# EAGLE design Retrolite_CM4_-_Right_PCB (EAGLE 9.6.2)
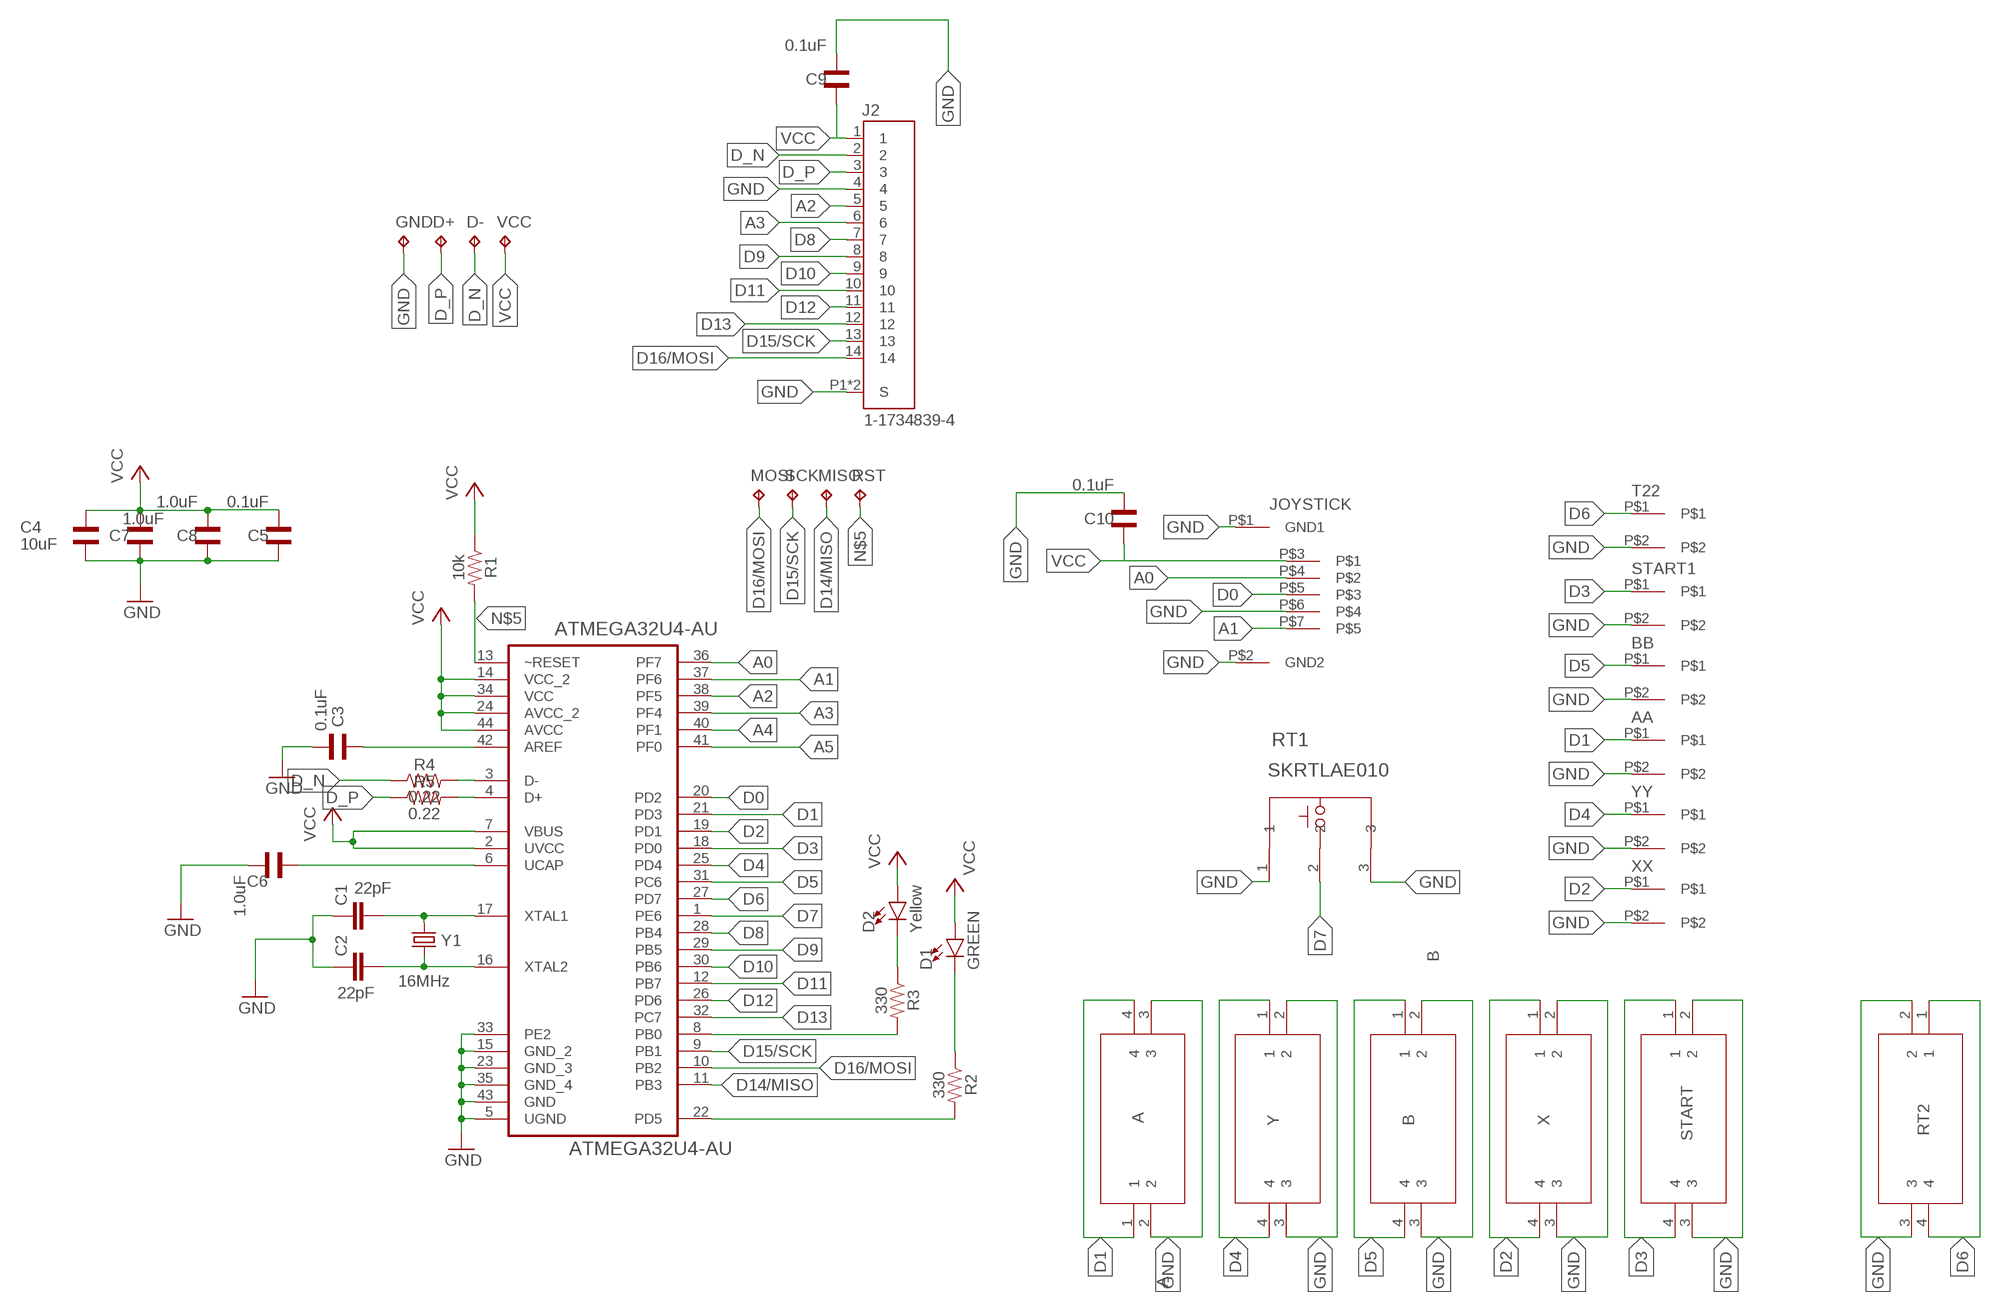
[diagram p0: schematic, sheet 1]

## Parts
A  A  EVQ-Q2B03W  [EVQQ2_3]
AA  MEMBRANEBUTTON  [MEMBRANEBUTTON]
ATMEGA32U4-AU  ATMEGA32U4-AU  [QFP80P1200X1200X120-44N]
B  B  EVQ-Q2B03W  [EVQQ2_3]
BB  MEMBRANEBUTTON  [MEMBRANEBUTTON]
C1  22pF  22PF-0603-50V-5%  [0603]
C2  22pF  22PF-0603-50V-5%  [0603]
C3  0.1uF  WCAP-CSGP_0805_885012006018_WAVE  [WCAP-CSGP_0805_WAVE]
C4  10uF  WCAP-CSGP_0805_885012006018_WAVE  [WCAP-CSGP_0805_WAVE]
C5  0.1uF  WCAP-CSGP_0805_885012006018_WAVE  [WCAP-CSGP_0805_WAVE]
C6  1.0uF  WCAP-CSGP_0805_885012006018_WAVE  [WCAP-CSGP_0805_WAVE]
C7  1.0uF  WCAP-CSGP_0805_885012006018_WAVE  [WCAP-CSGP_0805_WAVE]
C8  1.0uF  WCAP-CSGP_0805_885012006018_WAVE  [WCAP-CSGP_0805_WAVE]
C9  0.1uF  WCAP-CSGP_0805_885012006018_WAVE  [WCAP-CSGP_0805_WAVE]
C10  0.1uF  WCAP-CSGP_0805_885012006018_WAVE  [WCAP-CSGP_0805_WAVE]
D1  GREEN  LED-GREEN0603  [LED-0603]
D2  Yellow  LED-YELLOW0603  [LED-0603]
D+  TPB1,27  [B1,27]
D-  TPB1,27  [B1,27]
GND  TPB1,27  [B1,27]
J2  1-1734839-4  [TE_1-1734839-4]
JOYSTICK  0545500571  [0545500571]
MISO  TPB1,27  [B1,27]
MOSI  TPB1,27  [B1,27]
R1  10k  10KOHM-0603-1/10W-1%  [0603]
R2  330  1.6KOHM-0603-1/10W-1%  [0603]
R3  330  1.6KOHM-0603-1/10W-1%  [0603]
R4  0.22  0.22OHM-0805-1/4W-1%  [0805]
R5  0.22  0.22OHM-0805-1/4W-1%  [0805]
RST  TPB1,27  [B1,27]
RT1  SKRTLAE010  [SW3_SKRTLAE010_ALPS]
RT2  T2  EVQ-Q2B03W  [EVQQ2_3]
SCK  TPB1,27  [B1,27]
START  START  EVQ-Q2B03W  [EVQQ2_3]
START1  MEMBRANEBUTTON  [MEMBRANEBUTTON]
T22  MEMBRANEBUTTON  [MEMBRANEBUTTON]
VCC  TPB1,27  [B1,27]
X  X  EVQ-Q2B03W  [EVQQ2_3]
XX  MEMBRANEBUTTON  [MEMBRANEBUTTON]
Y  Y  EVQ-Q2B03W  [EVQQ2_3]
Y1  16MHz  CRYSTAL-16MHZSMD-5X3.2  [CRYSTAL-SMD-5X3.2-4PAD]
YY  MEMBRANEBUTTON  [MEMBRANEBUTTON]

## Nets
A0: ATMEGA32U4-AU.36(PF7) JOYSTICK.P$4
A1: ATMEGA32U4-AU.37(PF6) JOYSTICK.P$7
A2: ATMEGA32U4-AU.38(PF5) J2.5
A3: ATMEGA32U4-AU.39(PF4) J2.6
A4: ATMEGA32U4-AU.40(PF1)
A5: ATMEGA32U4-AU.41(PF0)
D0: ATMEGA32U4-AU.20(PD2) JOYSTICK.P$5
D1: A.1 A.4 AA.P$1 ATMEGA32U4-AU.21(PD3)
D2: ATMEGA32U4-AU.19(PD1) X.1 X.4 XX.P$1
D3: ATMEGA32U4-AU.18(PD0) START1.P$1 START.1 START.4
D4: ATMEGA32U4-AU.25(PD4) Y.1 Y.4 YY.P$1
D5: ATMEGA32U4-AU.31(PC6) B.1 B.4 BB.P$1
D6: ATMEGA32U4-AU.27(PD7) RT2.1 RT2.4 T22.P$1
D7: ATMEGA32U4-AU.1(PE6) RT1.2
D8: ATMEGA32U4-AU.28(PB4) J2.7
D9: ATMEGA32U4-AU.29(PB5) J2.8
D10: ATMEGA32U4-AU.30(PB6) J2.9
D11: ATMEGA32U4-AU.12(PB7) J2.10
D12: ATMEGA32U4-AU.26(PD6) J2.11
D13: ATMEGA32U4-AU.32(PC7) J2.12
D14/MISO: ATMEGA32U4-AU.11(PB3) MISO.TP
D15/SCK: ATMEGA32U4-AU.9(PB1) J2.13 SCK.TP
D16/MOSI: ATMEGA32U4-AU.10(PB2) J2.14 MOSI.TP
D_N [USBEXT]: D-.TP J2.2 R4.1
D_P [USBEXT]: D+.TP J2.3 R5.1
GND: A.2 A.3 AA.P$2 ATMEGA32U4-AU.5(UGND) ATMEGA32U4-AU.15(GND_2) ATMEGA32U4-AU.23(GND_3) ATMEGA32U4-AU.33(PE2) ATMEGA32U4-AU.35(GND_4) ATMEGA32U4-AU.43(GND) B.2 B.3 BB.P$2 C1.1 C2.1 C3.1 C4.1 C5.2 C6.1 C7.2 C8.2 C9.1 C10.1 GND.TP J2.4 J2.P1(S) J2.P2(S) JOYSTICK.P$1(GND1) JOYSTICK.P$2(GND2) JOYSTICK.P$6 RT1.1 RT1.3 RT2.2 RT2.3 START1.P$2 START.2 START.3 T22.P$2 X.2 X.3 XX.P$2 Y.2 Y.3 YY.P$2
N$1: ATMEGA32U4-AU.17(XTAL1) C1.2 Y1.1
N$2: ATMEGA32U4-AU.42(AREF) C3.2
N$3: ATMEGA32U4-AU.6(UCAP) C6.2
N$4: ATMEGA32U4-AU.16(XTAL2) C2.2 Y1.3
N$5: ATMEGA32U4-AU.13(~RESET) R1.2 RST.TP
N$6: ATMEGA32U4-AU.22(PD5) R2.2
N$7: ATMEGA32U4-AU.8(PB0) R3.2
N$8: D1.C R2.1
N$9: D2.C R3.1
USB_N [USB]: ATMEGA32U4-AU.3(D-) R4.2
USB_P [USB]: ATMEGA32U4-AU.4(D+) R5.2
VCC: ATMEGA32U4-AU.2(UVCC) ATMEGA32U4-AU.7(VBUS) ATMEGA32U4-AU.14(VCC_2) ATMEGA32U4-AU.24(AVCC_2) ATMEGA32U4-AU.34(VCC) ATMEGA32U4-AU.44(AVCC) C4.2 C5.1 C7.1 C8.1 C9.2 C10.2 D1.A D2.A J2.1 JOYSTICK.P$3 R1.1 VCC.TP

## Library data of the parts
A B RT2 START X Y = EVQ-Q2B03W:EVQ-Q2B03W; AVAILABILITY: Unavailable; DESCRIPTION: Tactile Switch SPST-NO Top Actuated Surface Mount; MF: Panasonic Electronic; MP: EVQQ2B03W; PACKAGE: None; PRICE: None
AA BB START1 T22 XX YY = Membrane Button:MEMBRANEBUTTON
ATMEGA32U4-AU = ATMEGA32U4-AU:ATMEGA32U4-AU: 8-bit Microcontroller with ISP Flash and USB Controller Check prices <https://pricing.snapeda.com/parts/ATMEGA32U4-AU/Microchip%20Technology/view-part?ref=eda>; AVAILABILITY: Good; DESCRIPTION: AVR AVR® ATmega Microcontroller IC 8-Bit 16MHz 32KB (16K x 16) FLASH 44-TQFP (10x10); MF: Microchip Technology; MP: ATMEGA32U4-AU; PACKAGE: TQFP-44 Microchip Technology; PRICE: None; PURCHASE-URL: https://pricing.snapeda.com/search/part/ATMEGA32U4-AU/?ref=eda
C1 C2 = SparkFun-Capacitors:22PF: 22pF ceramic capacitors A capacitor is a passive two-terminal electrical component used to store electrical energy temporarily in an electric field.; PROD_ID: CAP-07876
C3-C10 = Wurth_Elektronik_Passive_Capacitors_rev18b:WCAP-CSGP_0805: WCAP-CSGP Ceramic Capacitors Characteristics Multilayer Ceramic Chip Capacitor Recommended soldering:Reflow, for 0603 and 0805 wave soldering is also allowed Operating temperature:-55 °C to +125 °C; Ceramic characteristics: Class I - NPO ; Class II -X7R, X5R High performance ceramic High capacitance stability Minimal aging Termination:Cu/Ni/Sn <http://katalog.we-online.de/media/images/eisos/WCAP-CSGP_pf2.jpg> Details see: http://katalog.we-online.de/en/pbs/WCAP-CSGP-0805? Created: 2015-01-28 2015 (C) Wurth Elektronik
D1 = SparkFun-LED:LED-GREEN: Green SMD LED Used in manufacturing of various products at SparkFun Packages: 0603 - SMD 0603 package [Product Link] <http://www.futureelectronics.com/en/technologies/semiconductors/optoelectronics/leds/Pages/9894312-LTST-C190GKT.aspx?CrossPart=HSMG-C190&IM=0> LilyPad 1206 - SMD1206 LilyPad package [Product Link] <http://www.futureelectronics.com/en/Technologies/Product.aspx?ProductID=IN150NGHARVATEKCORPORATION2049943&IM=0> 1206 - SMD1206 package [Product Link] <http://www.futureelectronics.com/en/technologies/semiconductors/optoelectronics/leds/Pages/8315665-LTST-C150KGKT.aspx?IM=0> 1206 Bottom Mount -SMD 1206 Bottom Mount [Product Link] <http://www.digikey.com/product-detail/en/lite-on-inc/LTST-C230KGKT/160-1456-1-ND/386854> SparkFun Products: Pro Mini 328 -5V <https://www.sparkfun.com/products/821> RedBoard <https://www.sparkfun.com/products/12757> MP3 Trigger <https://www.sparkfun.com/products/13720> Makey Makey <https://www.sparkfun.com/products/11076>; PROD_ID: DIO-00821
D2 = SparkFun-LED:LED-YELLOW: Yellow SMD LED Used in manufacturing several products at SparkFun. Packages: 0603 - SMD 0603 package[Product Link] <http://www.kingbrightusa.com/product.asp?catalog_name=LED&product_id=APT1608SYCK> 0603 -SMART - SMART SMD 0603 package (more efficient/more expensive) [Product Link] <http://www.osram-os.com/osram_os/en/products/product-catalog/led-light-emitting-diodes/smartled-0603/ly-l29k/index.jsp> LilyPad - SMD1206 package[Product Datasheet] <https://www.sparkfun.com/datasheets/DevTools/LilyPad/Q150YUS4.pdf> SparkFun Products: Blynk Board <https://www.sparkfun.com/products/13794> IOIO-OTG <https://www.sparkfun.com/products/13613> XBee Explorer Serial <https://www.sparkfun.com/products/13225>; PROD_ID: DIO-09003
D+ D- GND MISO MOSI RST SCK VCC = testpad:TP: Test pad
J2 = 1-1734839-4:1-1734839-4: Conn FPC Connector SKT 14 POS 0.5mm Solder RA SMD T/R; COMMENT: 1-1734839-4; DESCRIPTION: Conn FPC Connector SKT 14 POS 0.5mm Solder RA SMD T/R; DIGI-KEY_PART_NUMBER: A100295CT-ND; EU_ROHS_COMPLIANCE: Compliant; MF: TE Connectivity; MP: 1-1734839-4; PACKAGE: None; PURCHASE-URL: https://pricing.snapeda.com/search/part/1-1734839-4/?ref=eda
JOYSTICK = Molex FFC:0545500571
R1 = SparkFun-Resistors:10KOHM: 10kΩ resistor A resistor is a passive two-terminal electrical component that implements electrical resistance as a circuit element. Resistors act to reduce current flow, and, at the same time, act to lower voltage levels within circuits. - Wikipedia; PROD_ID: RES-00824
R2 R3 = SparkFun-Resistors:1.6KOHM: 1.6kΩ resistor A resistor is a passive two-terminal electrical component that implements electrical resistance as a circuit element. Resistors act to reduce current flow, and, at the same time, act to lower voltage levels within circuits. - Wikipedia; PROD_ID: RES-08361; VALUE: 1.6k
R4 R5 = SparkFun-Resistors:0.22OHM: 0.22Ω resistor A resistor is a passive two-terminal electrical component that implements electrical resistance as a circuit element. Resistors act to reduce current flow, and, at the same time, act to lower voltage levels within circuits. - Wikipedia; PROD_ID: RES-09883
RT1 = SKRTLAE010:SKRTLAE010; BUILT_BY: EMA_Justin; COPYRIGHT: Copyright (C) 2016 Accelerated Designs. All rights reserved; MANUFACTURER_PART_NUMBER: SKRTLAE010; SOURCELIBRARY: ALPS_2018-12-15; VENDOR: ALPS
Y1 = SparkFun-Clocks:CRYSTAL-16MHZ: 16MHz Crystal Digikey Example <http://www.digikey.com/product-search/en?keywords=535-9122-1-ND> Frequency: 16MHz Frequency Stability: ±50ppm Frequency Tolerance: ±20ppm Load Capacitance: 18pF SparkFun Products: Pro Micro -5V/16MHz <https://www.sparkfun.com/products/12640> SparkFun Serial Enabled LCD Kit <https://www.sparkfun.com/products/10097>; PROD_ID: XTAL-08218; SF_ID: COM-00094

## Net classes
1 USB: width 0.254 mm
2 USBEXT: width 0.254 mm

## Board
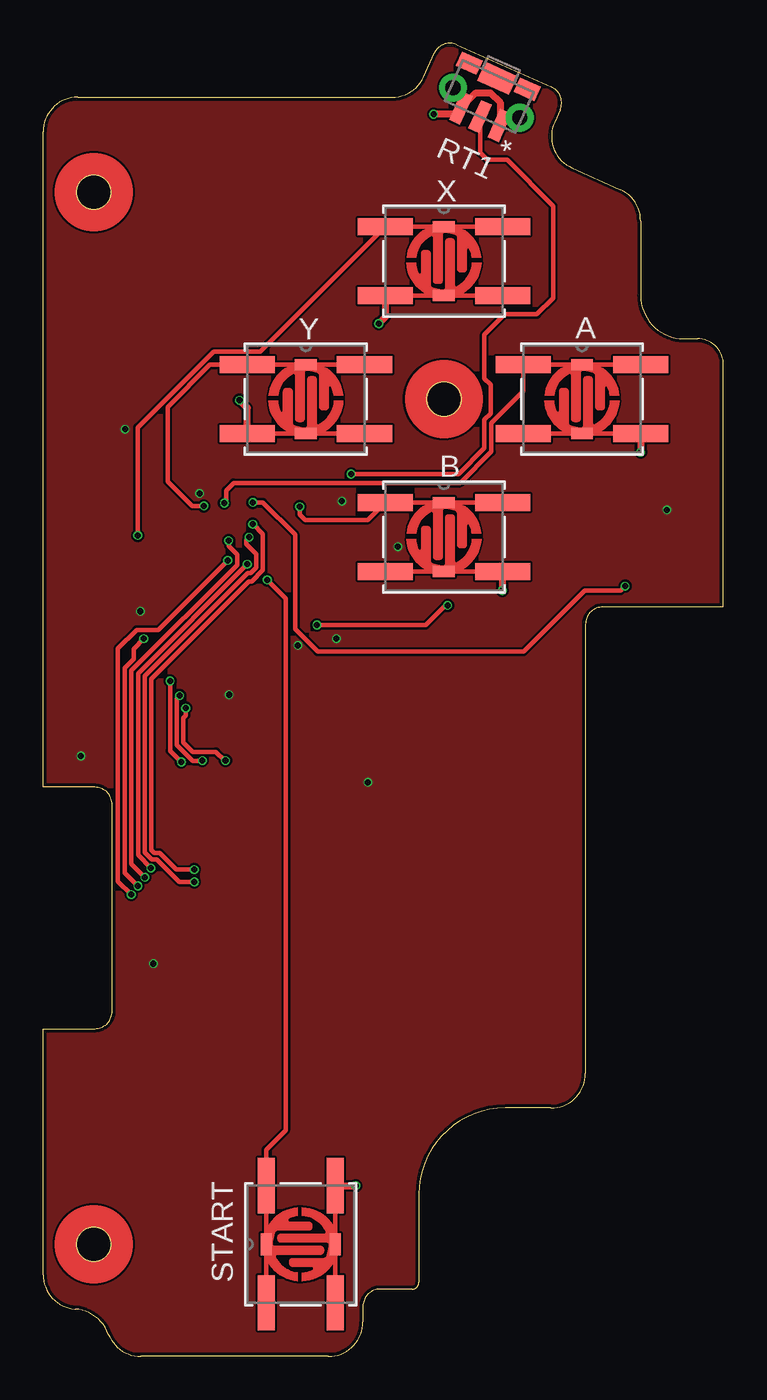
[diagram p1: board, top side]
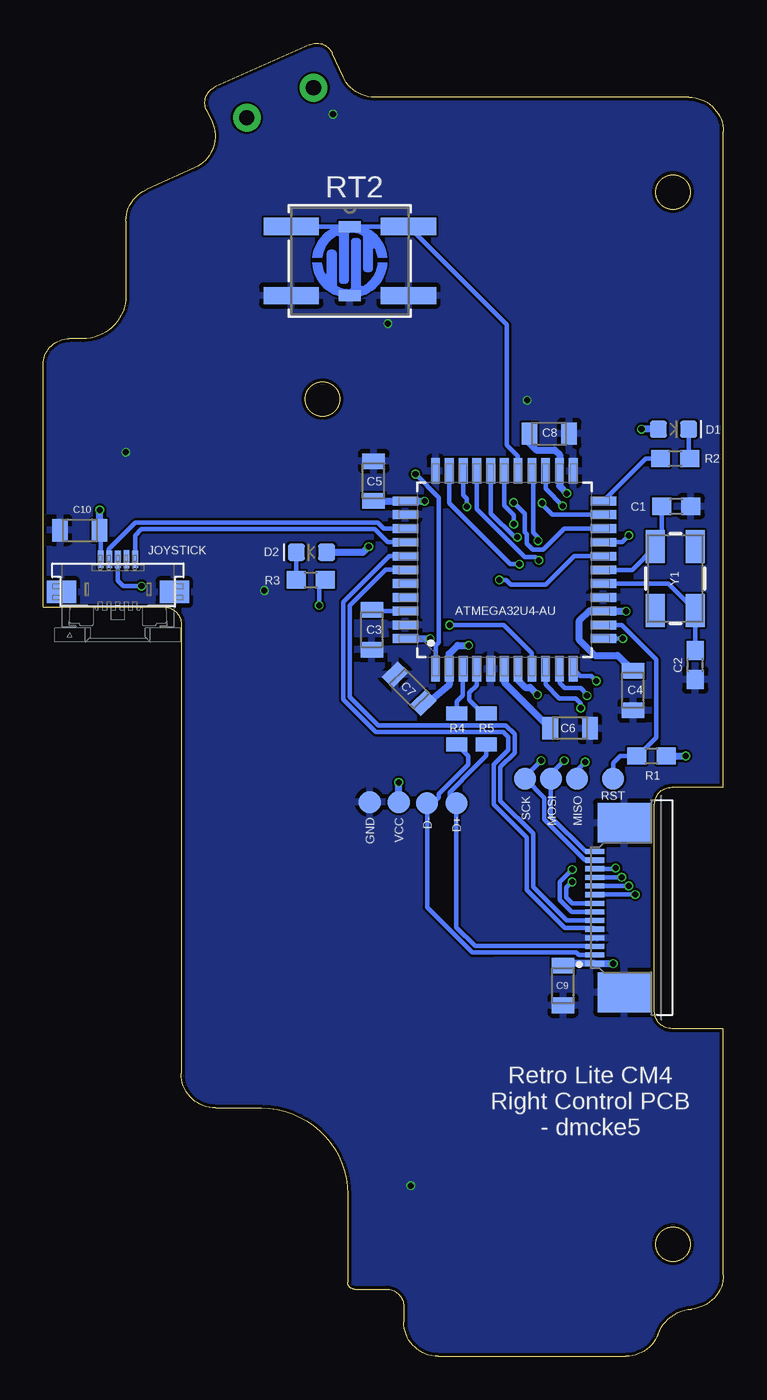
[diagram p2: board, bottom side, seen from below]

Size 39.43 x 76.14 mm. Coordinates in mm from the lower left corner, seen from the top.
Outline: 3,33 0,33 0,71 arc-90 2,73 20.23,73 arc66 22.05,74.18 22.66,75.55 arc-90 23.98,76.05 29.46,73.6 arc-90 29.96,72.28 29.64,71.55 arc90 30.65,68.91 33.45,67.66 arc-66 34.63,65.83 34.63,61.5 arc90 37.13,59 37.93,59 arc-90 39.43,57.5 39.43,43.45 32.43,43.45 arc90 31.43,42.45 31.43,16.39 arc-90 29.43,14.39 26.78,14.39 arc90 21.78,9.39 21.78,4.29 arc-90 21.38,3.89 19.53,3.89 arc90 18.53,2.89 18.53,2 arc-90 16.53,0 5.66,0 arc-69 3.79,1.29 arc65 1.85,2.74 arc-86 0,4.74 0,19 3,19 arc90 4,20 4,32 arc90 3,33
Outline: circle at 2.93,6.5 radius 1
Outline: circle at 23.23,55.5 radius 1
Outline: circle at 2.93,67.5 radius 1
Copper layers (1*16): Top 0.035mm / dielectric 1.6mm / Bottom 0.035mm
Design rules "jlcpcb-2layers *": minimum track width 5mil, minimum drill 0.3mm, track to track 5mil, track to pad 5mil, pad to pad 5mil, via to via 5mil, smd to smd 5mil, copper to edge 0.2mm, drill to drill 6mil, minimum pad ring 10mil, minimum via ring 3mil, stop-mask expansion 0mil, vias tented up to drill 50mil, thermal gap 10mil
tKeepout: 9 lines
bKeepout: 8 lines

### Footprints (pad centres in the part's own frame; a part is rotated, then mirrored left to right if it is on the bottom)
EVQQ2_3 = smd 3.2 x 0.991: 1 -3.4,2; 2 -3.4,-2; 3 3.4,-2; 4 3.4,2
MEMBRANEBUTTON = smd 0.635 x 1.27: P$1 2,0; P$2 -2,0
QFP80P1200X1200X120-44N = smd 1.473 x 0.508: 1 -5.74,3.988; 2 -5.74,3.2; 3 -5.74,2.388; 4 -5.74,1.6; 5 -5.74,0.787; 6 -5.74,0; 7 -5.74,-0.787; 8 -5.74,-1.6; 9 -5.74,-2.388; 10 -5.74,-3.2; 11 -5.74,-3.988; 23 5.74,-3.988; 24 5.74,-3.2; 25 5.74,-2.388; 26 5.74,-1.6; 27 5.74,-0.787; 28 5.74,0; 29 5.74,0.787; 30 5.74,1.6; 31 5.74,2.388; 32 5.74,3.2; 33 5.74,3.988 | smd 0.508 x 1.473: 12 -3.988,-5.74; 13 -3.2,-5.74; 14 -2.388,-5.74; 15 -1.6,-5.74; 16 -0.787,-5.74; 17 0,-5.74; 18 0.787,-5.74; 19 1.6,-5.74; 20 2.388,-5.74; 21 3.2,-5.74; 22 3.988,-5.74; 34 3.988,5.74; 35 3.2,5.74; 36 2.388,5.74; 37 1.6,5.74; 38 0.787,5.74; 39 0,5.74; 40 -0.787,5.74; 41 -1.6,5.74; 42 -2.388,5.74; 43 -3.2,5.74; 44 -3.988,5.74
0603 = smd 1.1 x 1: 1 -0.85,0; 2 0.85,0
WCAP-CSGP_0805_WAVE = smd 0.9 x 1.3: 1 -1.15,0; 2 1.15,0
LED-0603 = smd 1 x 1: A -0.877,0; C 0.877,0
B1,27 = smd 1.27 x 1.27: TP 0,0
TE_1-1734839-4 = smd 0.3 x 1.1: 1 -3.25,0; 2 -2.75,0; 3 -2.25,0; 4 -1.75,0; 5 -1.25,0; 6 -0.75,0; 7 -0.25,0; 8 0.25,0; 9 0.75,0; 10 1.25,0; 11 1.75,0; 12 2.25,0; 13 2.75,0; 14 3.25,0 | smd 2.3 x 3.1: P1 -4.92,-1.7; P2 4.92,-1.7
0545500571 = smd 1.65 x 1.3: P$1 -2.275,-0.65; P$2 4.275,-0.65 | smd 0.3 x 1: P$3 0,1.25; P$4 0.5,1.25; P$5 1,1.25; P$6 1.5,1.25; P$7 2,1.25
0805 = smd 0.8 x 1.2: 1 -0.9,0; 2 0.9,0
SW3_SKRTLAE010_ALPS = smd 0.686 x 1.8: 1 0,0; 2 1.23,0; 3 2.46,0 | drill 0.889 pad 0.889: 4 -0.889,-0.889; 5 3.353,-0.889 | smd 1.3 x 0.9: 6 -0.62,-2.565; 8 3.08,-2.565 | smd 2.007 x 1.194: 7 1.23,-2.438
CRYSTAL-SMD-5X3.2-4PAD = smd 1.9 x 1.1: 1 -1.85,-1.15; 2 1.85,-1.15; 3 1.85,1.15; 4 -1.85,1.15

### Placement (x,y rotation side)
A  31.23,55.5 0 top
AA  31.23,55.5 90 top
ATMEGA32U4-AU  12.7,45.6 90 bottom
B  23.23,47.5 0 top
BB  23.23,47.5 90 top
C1  2.74,49.28 180 bottom
C2  1.63,40.08 90 bottom
C3  20.38,42.13 90 bottom
C4  5.24,38.61 90 bottom
C5  20.28,50.75 90 bottom
C6  8.89,36.41 180 bottom
C7  18.21,38.71 135 bottom
C8  10.1,53.5 0 bottom
C9  9.3,21.5 90 bottom
C10  37.3,47.9 0 bottom
D1  2.9,53.75 0 bottom
D2  23.88,46.62 180 bottom
D+  15.48,32.08 0 bottom
D-  17.17,32.08 0 bottom
GND  20.5,32.13 0 bottom
J2  7.45,26.02 90 bottom
JOYSTICK  36.1,44.97 0 bottom
MISO  8.5,33.5 0 bottom
MOSI  10,33.5 0 bottom
R1  4.17,34.81 180 bottom
R2  2.8,52.05 180 bottom
R3  23.92,45.02 0 bottom
R4  15.46,36.38 90 bottom
R5  13.75,36.38 90 bottom
RST  6.4,33.5 0 bottom
RT1  26.45,71.37 155.8 top
RT2  21.65,63.51 0 bottom
SCK  11.5,33.5 0 bottom
START  14.93,6.5 90 top
START1  14.93,6.5 180 top
T22  21.65,63.51 90 bottom
VCC  18.82,32.13 0 bottom
X  23.23,63.5 0 top
XX  23.23,63.5 90 top
Y  15.23,55.5 0 top
Y1  2.79,45.1 270 bottom
YY  15.23,55.5 90 top

### Tracks (layer width: path | path; a pad name or v marks a point on that pad's centre or on a via)
A0
  Bottom 0.254: ATMEGA32U4-AU.36 19.7,47.99 20.05,48.34 34.09,48.34 35.61,46.81 35.61,46.23 JOYSTICK.P$4
A1
  Bottom 0.254: ATMEGA32U4-AU.37 19.45,47.2 20.2,47.95 33.74,47.95 34.1,47.59 JOYSTICK.P$7
A2
  Bottom 0.254: ATMEGA32U4-AU.38 19.38,46.39 22.03,43.74 22.03,38.07 20.16,36.2 12.77,36.2 12.48,35.91 12.48,35.15 13.31,34.32 13.31,31.99 11.41,30.09 11.41,27.05 9.19,24.83 7.51,24.83 J2.5
A3
  Bottom 0.254: ATMEGA32U4-AU.39 19.58,45.61 21.65,43.54 21.65,38.23 20,36.58 12.61,36.58 12.1,36.08 12.1,34.99 12.93,34.16 12.93,32.21 11.03,30.31 11.03,27.22 9.08,25.27 J2.6
D0  (via drill 0.35)
  Top 0.254: v12.16,49.51 12.73,49.51 14.61,47.63 14.61,42.16 15.91,40.86 27.85,40.86 31.38,44.39 33.47,44.39 v33.73,44.65
  Bottom 0.254: v33.73,44.65 34.78,44.65 35.1,44.97 JOYSTICK.P$5 | v12.16,49.51 11.52,48.87 11.52,47.78 11.4,47.66 11.4,47.13 11.06,46.78 10.44,46.78 9.23,47.99 ATMEGA32U4-AU.20
D1  (via drill 0.35)
  Top 0.254: v10.51,49.47 10.61,49.56 10.61,50.2 11.05,50.64 24.17,50.64 25.98,52.45 25.98,54.1 27.83,55.95 A.1 AA.P$1 A.4
  Bottom 0.254: ATMEGA32U4-AU.21 9.91,48.8 10.51,49.4 v10.51,49.47
D2  (via drill 0.35)
  Top 0.254: v5.48,47.6 5.48,53.85 9.88,58.25 12.58,58.25 X.1 XX.P$1 X.4
  Bottom 0.254: ATMEGA32U4-AU.19 5.88,47.2 v5.48,47.6
D3  (via drill 0.35)
  Top 0.254: v12.98,45.02 14.05,43.95 14.05,13.1 12.93,11.98 START.4 START1.P$1 START.1
  Bottom 0.254: ATMEGA32U4-AU.18 8.65,46.39 10.29,44.75 12.32,44.75 12.59,45.02 v12.98,45.02
D4  (via drill 0.35)
  Top 0.254: v9.32,49.31 8.64,49.31 7.22,50.73 7.22,55.05 9.67,57.5 Y.1 YY.P$1 Y.4
  Bottom 0.254: ATMEGA32U4-AU.25 10.31,50.3 v9.32,49.31
D5  (via drill 0.35)
  Top 0.254: B.4 BB.P$1 B.1 18.82,48.49 15.19,48.49 14.87,48.81 v14.87,49.26
  Bottom 0.254: ATMEGA32U4-AU.31 15.09,49.95 14.87,49.73 v14.87,49.26
D6
  Bottom 0.254: ATMEGA32U4-AU.27 11.91,52.2 12.55,52.84 12.55,59.81 RT2.4 T22.P$1 RT2.1
D7  (via drill 0.35)
  Top 0.254: v17.85,51.15 24.07,51.15 25.58,52.66 25.58,54.31 25.93,54.66 25.93,56.34 25.58,56.69 25.58,59.24 26.76,60.42 28.62,60.42 29.56,61.36 29.56,66.7 26.89,69.37 25.74,69.37 25.33,69.78 RT1.2
  Bottom 0.254: ATMEGA32U4-AU.1 16.69,41.21 16.5,41.4 16.5,49.8 v17.85,51.15
D8  (via drill 0.35)
  Top 0.254: v12.15,48.25 12.16,48.25 12.73,47.68 12.73,45.58 12.09,44.93 11.91,44.93 6.26,39.28 6.26,29.38 6.44,29.2 6.75,29.2 7.72,28.22 v8.76,28.22
  Bottom 0.254: ATMEGA32U4-AU.28 12.7,49.33 12.15,48.78 v12.15,48.25 | J2.7 8.8,25.78 9.48,26.45 9.48,27.51 8.98,28.02 8.96,28.02 v8.76,28.22
D9  (via drill 0.35)
  Top 0.254: v11.94,47.49 11.78,47.33 11.78,47.09 12.34,46.53 12.34,45.73 12.04,45.42 11.86,45.42 5.88,39.44 5.88,29.22 6.28,28.81 6.59,28.81 7.89,27.51 v8.77,27.51
  Bottom 0.254: ATMEGA32U4-AU.29 13.49,48.87 12.11,47.49 v11.94,47.49 | v8.77,27.51 9.1,27.18 9.1,26.61 8.76,26.27 J2.8
D10  (via drill 0.35)
  Top 0.254: v10.7,46.15 6.66,42.12 5.42,42.12 4.34,41.03 4.34,27.54 v5.11,26.77
  Bottom 0.254: ATMEGA32U4-AU.30 14.3,49.13 11.52,46.35 10.9,46.35 v10.7,46.15 | J2.9 v5.11,26.77
D11  (via drill 0.35)
  Top 0.254: v5.83,41.61 5.24,41.02 5.24,40.42 4.74,39.92 4.74,28.03 v5.49,27.28
  Bottom 0.254: ATMEGA32U4-AU.12 v5.83,41.61 | J2.10 v5.5,27.27 v5.49,27.28
D12  (via drill 0.35)
  Top 0.254: v10.75,47.29 10.75,46.99 11.25,46.49 11.25,45.89 5.12,39.76 5.12,28.56 v5.9,27.78
  Bottom 0.254: ATMEGA32U4-AU.26 11.02,51.26 11.02,47.76 10.75,47.49 v10.75,47.29 | J2.11 v5.9,27.78
D13  (via drill 0.35)
  Top 0.254: v11.83,45.93 5.5,39.6 5.5,29.06 v6.25,28.31
  Bottom 0.254: ATMEGA32U4-AU.32 15.9,49.47 12.36,45.93 v11.83,45.93 | v6.25,28.31 6.29,28.27 J2.12
D14/MISO  (via drill 0.35)
  Top 0.254: v7.36,39.16 7.36,35.11 v8.01,34.46
  Bottom 0.254: ATMEGA32U4-AU.11 8.31,39.46 7.66,39.46 v7.36,39.16 | v8.01,34.46 8.5,33.97 MISO.TP
D15/SCK  (via drill 0.35)
  Top 0.254: v8.27,37.58 8.27,37.16 8.13,37.02 8.13,35.6 8.68,35.05 10.01,35.05 10.51,34.54 v10.57,34.54
  Bottom 0.254: v8.27,37.58 8.27,37.85 8.57,38.15 9.51,38.15 10.31,38.95 ATMEGA32U4-AU.9 | v10.57,34.54 11.5,33.61 SCK.TP 10.38,32.38 10.38,31.12 8.04,28.78 J2.13
D16/MOSI  (via drill 0.35)
  Top 0.254: v7.91,38.31 7.75,38.15 7.75,35.44 8.66,34.53 v9.22,34.53 v9.23,34.54
  Bottom 0.254: ATMEGA32U4-AU.10 9.49,39.04 9.19,38.74 8.28,38.74 7.91,38.37 v7.91,38.31 | v9.23,34.54 10,33.77 MOSI.TP 10,31.28 7.99,29.27 J2.14
D_N
  Bottom 0.254: R4.1 14.8,34.82 14.8,34.32 16.52,32.6 16.52,32.42 16.85,32.08 D-.TP 17.17,26.03 14.56,23.42 | J2.2 8.38,23.27 8.53,23.42 13.38,23.42 | 13.38,23.42 | 14.56,23.42 13.38,23.42 | 14.56,23.42
D_P
  Bottom 0.254: R5.1 13.75,34.85 14.41,34.18 14.41,34.16 15.88,32.7 15.88,32.48 D+.TP 15.48,24.88 14.4,23.8 | J2.3 7.48,23.8 14.4,23.8 | 14.4,23.8
GND  (via drill 0.35)
  Top 0.254: Y.3 YY.P$2 Y.2 | X.3 XX.P$2 X.2 | A.3 AA.P$2 A.2 | B.3 BB.P$2 B.2 | START.3 START1.P$2 START.2
  Top 0.406: A.3 v34.63,52.42 | B.3 26.61,45.48 v26.61,44.4 | START.3 v18.12,9.9 | Y.2 11.83,54.98 v11.38,55.43 | X.2 19.83,60.26 v19.45,59.88 | RT1.1 26.49,71.41 26.49,72.7 25.93,73.26 25.08,73.26 24.21,72.39 RT1.3 23.85,72.02 v22.63,72.02
  pour Bottom: 28,78 41,65 41,39 34,32 34,9 23,-2 -1,-2 -4,1 -4,74 0,78
N$1
  Bottom 0.254: ATMEGA32U4-AU.17 5.29,45.6 Y1.1 3.59,47.3 C1.2
N$2
  Bottom 0.254: ATMEGA32U4-AU.42 20.31,43.21 C3.2
N$3
  Bottom 0.406: ATMEGA32U4-AU.6 12.7,39.07 C6.2
N$4
  Bottom 0.254: ATMEGA32U4-AU.16 3.2,44.81 Y1.3 C2.2
N$5
  Bottom 0.254: RST.TP 6.4,34.4 5.99,34.81 R1.2 4.96,34.81 3.89,35.88 3.89,40.39 5.9,42.4 ATMEGA32U4-AU.13
N$6
  Bottom 0.254: R2.2 4.5,52.05 ATMEGA32U4-AU.22
N$7  (via drill 0.35)
  Top 0.254: v15.87,42.4 22.17,42.4 23.31,43.54 v23.44,43.54
  Bottom 0.254: ATMEGA32U4-AU.8 11.11,40.77 12.74,42.41 v15.86,42.41 v15.87,42.4 | R3.2 23.44,44.65 v23.44,43.54
N$8
  Bottom 0.254: D1.C 2.02,52.12 R2.1
N$9
  Bottom 0.254: R3.1 24.76,45.03 D2.C
USB_N
  Bottom 0.254: R4.2 15.46,37.96 15.1,38.31 15.1,39.85 ATMEGA32U4-AU.3
USB_P
  Bottom 0.254: R5.2 13.95,37.28 14.72,38.05 14.72,38.48 14.3,38.9 ATMEGA32U4-AU.4
VCC  (via drill 0.35)
  Bottom 0.254: JOYSTICK.P$3 36.1,47.85 C10.2
  Bottom 0.406: C9.2 9.18,22.77 J2.1 v6.39,22.77 | R1.1 v2.19,34.81 | VCC.TP v18.82,33.28 | v10.78,38.36 11.21,38.79 11.49,38.79 11.91,39.22 ATMEGA32U4-AU.7 | C10.2 v36.15,49.08 | C5.1 20.27,49.59 ATMEGA32U4-AU.34 v17.33,49.59 v17.32,49.58 | C7.1 17.1,37.9 15.9,38.92 ATMEGA32U4-AU.2 15.9,40.72 15.41,41.22 v14.77,41.22 | C4.2 6.13,40.65 7.45,40.65 8.38,41.57 8.38,42.62 7.77,43.22 6.97,43.22 ATMEGA32U4-AU.14 6.95,43.2 v5.64,43.2 | ATMEGA32U4-AU.44 v17,41.61 | C8.1 11.25,52.95 10.86,52.56 9.78,52.56 9.5,52.27 ATMEGA32U4-AU.24 9.5,50.46 v9.07,50.03 | D1.A v4.75,53.75 | D2.A 20.88,46.62 v20.56,46.94
  pour Top: 30,76 41,65 41,39 34,32 34,9 23,-2 -1,-2 -4,1 -4,74 0,78 26,78 28,78
(copper drawn outside any net)
  shapes: Top circle x3

### Text on the board
bNames: ATMEGA32U4-AU | Retro Lite CM4 / Right Control PCB / - dmcke5